# Altium schematic sheet Mezzanine TXR-4 met sensor.SchDoc: SZG-TEMPLATE-TXR
size B; Organization: Opal Kelly; Address1: 13500 SW 72nd Ave STE 100; Address2: Portland, OR  97223; Address3: 217.391.3724; Address4: http://www.opalkelly.com; DocumentNumber: xxx; Revision: 1; SheetNumber: 1; SheetTotal: 1; PageSetup: Record=PageOptions|CenterHorizontal=True|CenterVertical=True|PrintScale=0.52|XCorrection=1.00|YCorrection=1.00|PrintKind=0|BorderSize=5000000|LeftOffset=0|BottomOffset=0|Orientation=2|PaperLength=1000|PaperWidth=1000|Scale=100|PaperSource=7|PrintQuality=-4|MediaType=1|DitherType=10|PaperKind=Letter|PrintScaleMode=1
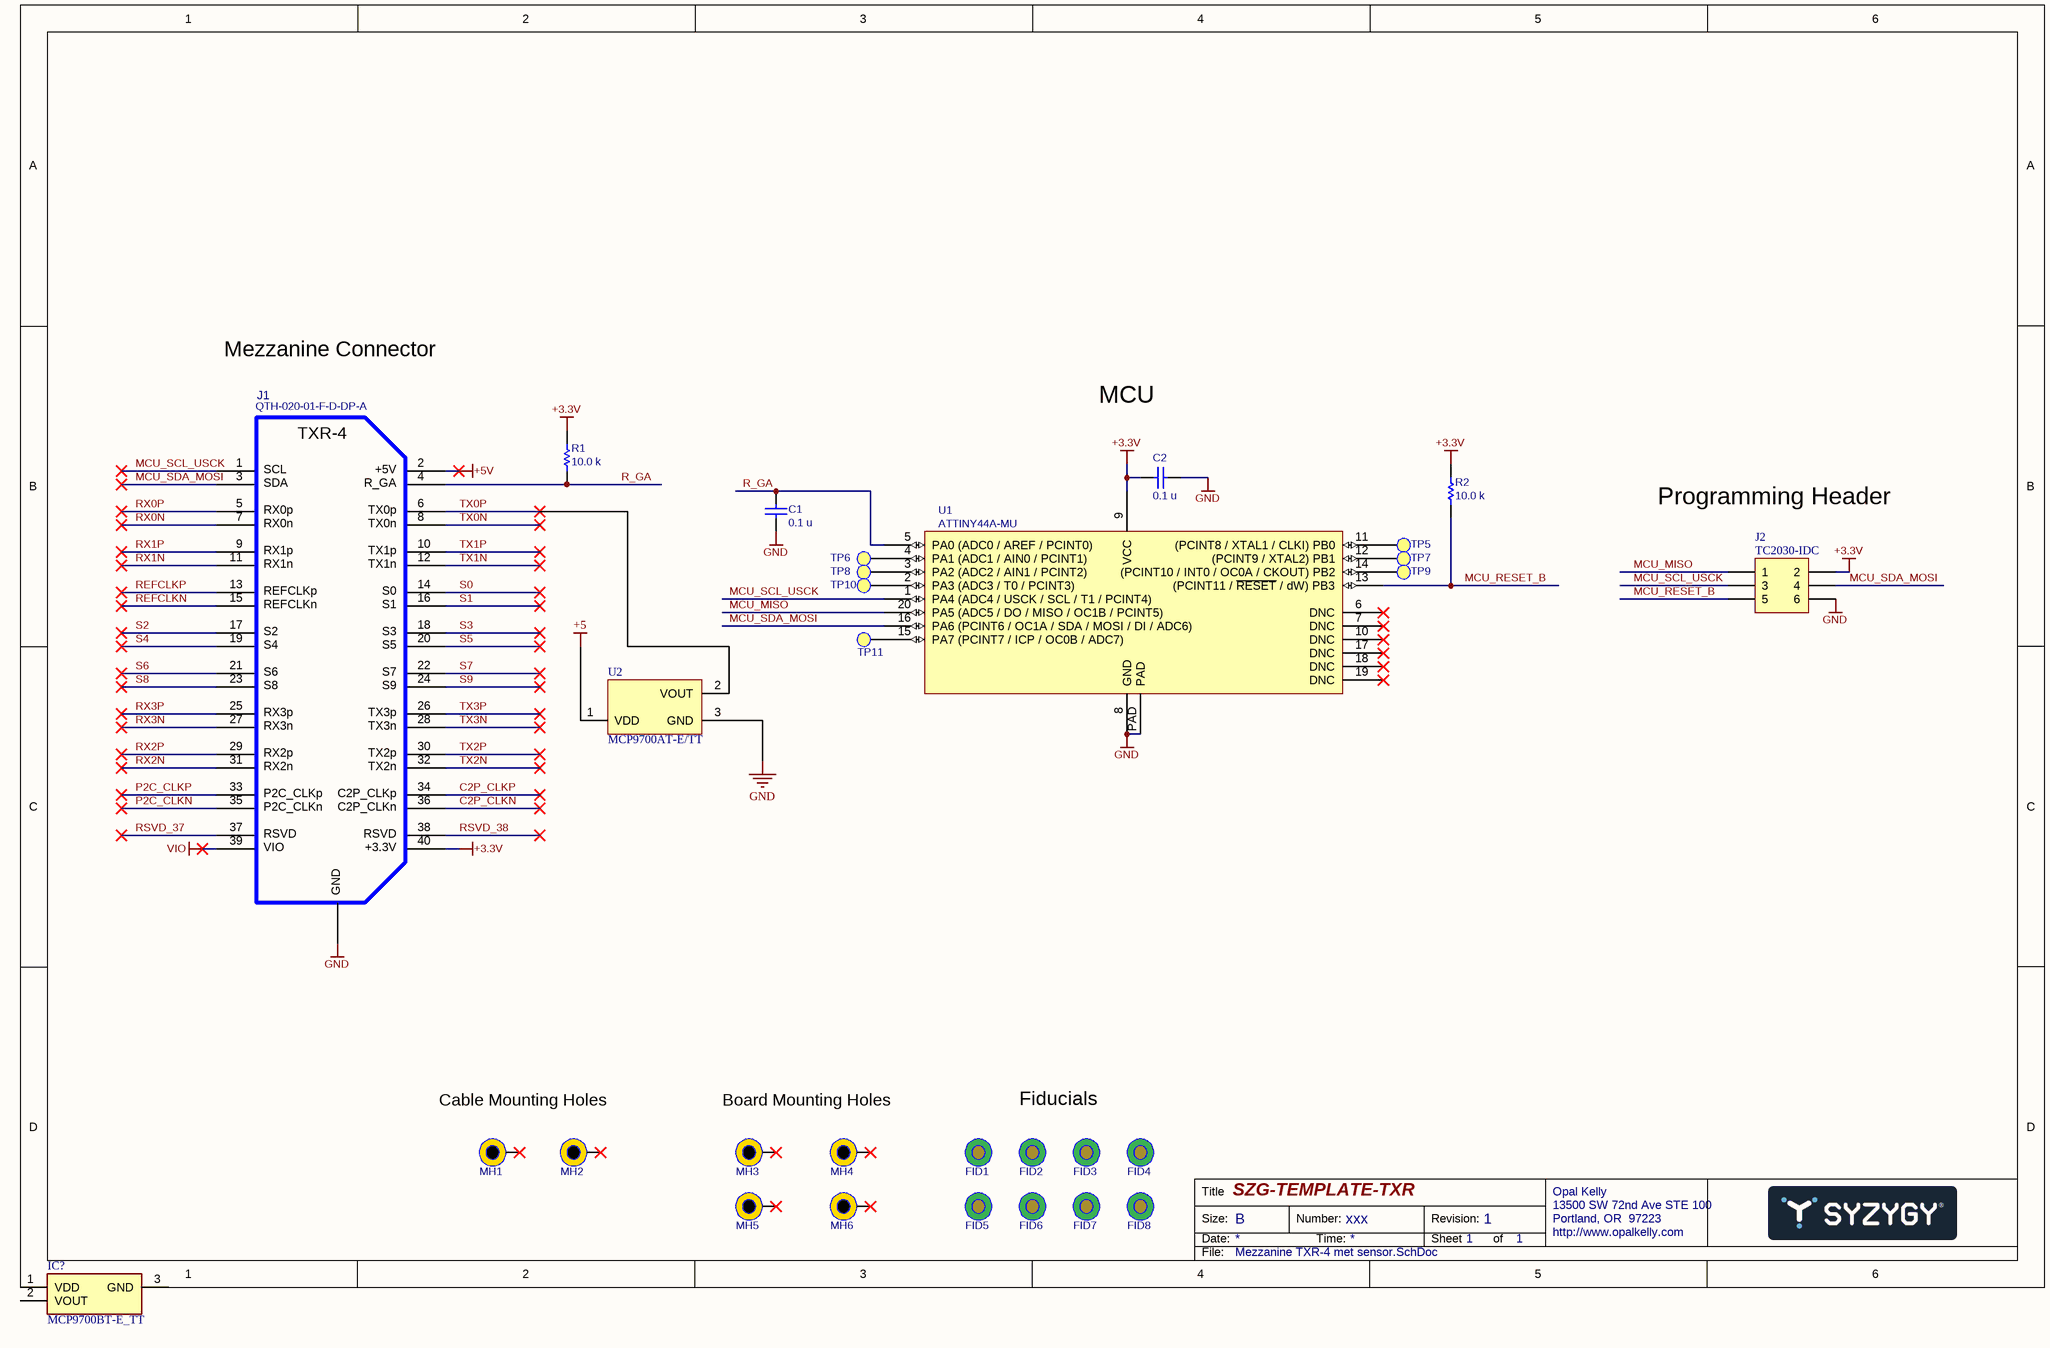
[diagram p0: Mezzanine TXR-4 met sensor.SchDoc]

## Parts
C1  value 0.1 u  [CAPC1005X06N]  (hidden comment: C0402C104K8PACTU)
C2  value 0.1 u  [CAPC1005X06N]  (hidden comment: C0402C104K8PACTU)
FID1  FIDUCIAL  [FID1MM/2MM-SS]  (value not drawn)
FID2  FIDUCIAL  [FID1MM/2MM-SS]  (value not drawn)
FID3  FIDUCIAL  [FID1MM/2MM-SS]  (value not drawn)
FID4  FIDUCIAL  [FID1MM/2MM-SS]  (value not drawn)
FID5  FIDUCIAL  [FID1MM/2MM-SS]  (value not drawn)
FID6  FIDUCIAL  [FID1MM/2MM-SS]  (value not drawn)
FID7  FIDUCIAL  [FID1MM/2MM-SS]  (value not drawn)
FID8  FIDUCIAL  [FID1MM/2MM-SS]  (value not drawn)
IC?  MCP9700BT-E_TT  [SOT95P237X112-3N]
J1  manufacturer_pn: QTH-020-01-F-D-DP-A  [QTH-020-01-X-D-DP-A-L]  (hidden comment: 40-pin, ground protection in middle)
J2  Manufacturer_PN: TC2030-IDC  [TC2030-DUAL]
MH1  MTG  [MTG-3.2/6.5-PTH]  (value not drawn)
MH2  MTG  [MTG-3.2/6.5-PTH]  (value not drawn)
MH3  MTG  [MTG-3.2/6.5-PTH]  (value not drawn)
MH4  MTG  [MTG-3.2/6.5-PTH]  (value not drawn)
MH5  MTG  [MTG-3.2/6.5-PTH]  (value not drawn)
MH6  MTG  [MTG-3.2/6.5-PTH]  (value not drawn)
R1  value 10.0 k  [RESC1005X06N]  (hidden comment: CRCW040210K0FKED)
R2  value 10.0 k  [RESC1005X06N]  (hidden comment: CRCW040210K0FKED)
TP5  TESTPOINT-SMD20  [TP-SMD20]  (value not drawn)
TP6  TESTPOINT-SMD20  [TP-SMD20]  (value not drawn)
TP7  TESTPOINT-SMD20  [TP-SMD20]  (value not drawn)
TP8  TESTPOINT-SMD20  [TP-SMD20]  (value not drawn)
TP9  TESTPOINT-SMD20  [TP-SMD20]  (value not drawn)
TP10  TESTPOINT-SMD20  [TP-SMD20]  (value not drawn)
TP11  TESTPOINT-SMD20  [TP-SMD20]  (value not drawn)
U1  ATTINY44A-MU  [QFN-EP-20]
U2  MCP9700AT-E/TT  [SOT-23-TT3_L]

## Nets
+3.3V: C2.2 J1.40 J2.2 R1.2 R2.2 U1.9(VCC)
+5: U2.1(VDD)
+5V: J1.2
GND: C1.1 C2.1 J1.0(GND) J2.6 U1.8(GND) U1.PAD U2.3(GND)
VIO: J1.39
C2P_CLKN: J1.36
C2P_CLKP: J1.34
MCU_MISO: J2.1 U1.20(PA5_(ADC5_/_DO_/_MISO_/_OC1B_/_PCINT5))
MCU_RESET_B: J2.5 R2.1 U1.13((PCINT11_/_~{RESET}_/_dW)_PB3)
MCU_SCL_USCK: J1.1 J2.3 U1.1(PA4_(ADC4_/_USCK_/_SCL_/_T1_/_PCINT4))
MCU_SDA_MOSI: J1.3 J2.4 U1.16(PA6_(PCINT6_/_OC1A_/_SDA_/_MOSI_/_DI_/_ADC6))
P2C_CLKN: J1.35
P2C_CLKP: J1.33
R_GA: C1.2 J1.4 R1.1 U1.5(PA0_(ADC0_/_AREF_/_PCINT0))
REFCLKN: J1.15
REFCLKP: J1.13
RSVD_37: J1.37
RSVD_38: J1.38
RX0N: J1.7
RX0P: J1.5
RX1N: J1.11
RX1P: J1.9
RX2N: J1.31
RX2P: J1.29
RX3N: J1.27
RX3P: J1.25
S0: J1.14
S1: J1.16
S2: J1.17
S3: J1.18
S4: J1.19
S5: J1.20
S6: J1.21
S7: J1.22
S8: J1.23
S9: J1.24
TX0N: J1.8
TX0P: J1.6 U2.2(VOUT)
TX1N: J1.12
TX1P: J1.10
TX2N: J1.32
TX2P: J1.30
TX3N: J1.28
TX3P: J1.26
NetTP5_1: TP5.1(PIN) U1.11((PCINT8_/_XTAL1_/_CLKI)_PB0)
NetTP6_1: TP6.1(PIN) U1.4(PA1_(ADC1_/_AIN0_/_PCINT1))
NetTP7_1: TP7.1(PIN) U1.12((PCINT9_/_XTAL2)_PB1)
NetTP8_1: TP8.1(PIN) U1.3(PA2_(ADC2_/_AIN1_/_PCINT2))
NetTP9_1: TP9.1(PIN) U1.14((PCINT10_/_INT0_/_OC0A_/_CKOUT)_PB2)
NetTP10_1: TP10.1(PIN) U1.2(PA3_(ADC3_/_T0_/_PCINT3))
NetTP11_1: TP11.1(PIN) U1.15(PA7_(PCINT7_/_ICP_/_OC0B_/_ADC7))

Not connected (* = marked no-connect by the designer): IC? 1(VDD) 2(VOUT) 3(GND); MH1 1*; MH2 1*; MH3 1*; MH4 1*; MH5 1*; MH6 1*; U1 6(DNC)* 7(DNC)* 10(DNC)* 17(DNC)* 18(DNC)* 19(DNC)*

## Notes on the sheet
- Mezzanine Connector
- MCU
- Programming Header
- Cable Mounting Holes
- Board Mounting Holes
- Fiducials
- Title
- Size:
- Date:
- B
- Number:
- Time:
- Revision:
- Sheet
- of
- File:
- (in symbol 001605) TXR-4; SCL; +5V; SDA; R_GA; RX0p; TX0p; RX0n; TX0n; RX1p; TX1p; RX1n; TX1n; REFCLKp; S0; REFCLKn; S1; S2; S3; S4; S5; S6; S7; S8; S9; RX3p; TX3p; RX3n; TX3n; RX2p; TX2p; RX2n; TX2n; P2C_CLKp; C2P_CLKp; P2C_CLKn; C2P_CLKn; RSVD; VIO; +3.3V

## Library data of the parts
C1 C2 = 000070: Ceramic capacitor; Manufacturer: Kemet; partnumber: 000070; Description 2: SM-0402, 10%, 10v; ValueFloat: 1E-7; Tolerance (%): 10; Manufacturer_PN: C0402C104K8PACTU
  C1: updated_on: 5/15/2017 4:50:04 PM
  C2: updated_on: 11/17/2016 12:16:56 PM
FID1-FID8 = FIDUCIAL: PCB fiducial
IC? = MCP9700BT-E_TT: Integrated Circuit; Manufacturer_Name: Microchip; Manufacturer_Part_Number: MCP9700BT-E/TT; Datasheet Link: https://www.arrow.com/en/products/mcp9700bt-ett/microchip-technology?region=nac; Height: 1.12mm; Mouser Part Number: 494-MCP9700BT-E/TT; Mouser Price/Stock: https://www.mouser.co.uk/ProductDetail/Microchip-Technology/MCP9700BT-E-TT?qs=Y0Uzf4wQF3lsXhjo%252Bepn1A%3D%3D; Arrow Part Number: MCP9700BT-E/TT; Arrow Price/Stock: https://www.arrow.com/en/products/mcp9700bt-ett/microchip-technology?region=nac
J1 = 001605: 0.5mm hi-speed, high-density header (female); manufacturer: Samtec; AligniPartNumber: 001605; parttype: Connector
J2 = 002062: Tag-Connect 6-pin Plug-of-Nails spring-pin cable footprint; AligniPartNumber: 002062; Manufacturer: Tag-Connect; parttype: Connector
MH1-MH6 = MTG: Mounting hole
R1 R2 = 001521: Thick-film resistor; Manufacturer: Vishay; partnumber: 001521; Description 2: SM-0402, 1%, 1/16W; ValueFloat: 10000; Tolerance (%): 1; x_lifecycle_status: Production; Manufacturer_PN: CRCW040210K0FKED; updated_on: 3/21/2017 2:29:49 PM
TP5-TP11 = TESTPOINT-SMD20: Test point, surface-mount, 20mil
U1 = 001552: 8-bit MCU, 4 KB flash, 256 bytes EEPROM; Manufacturer: Microchip; partnumber: 001552; x_lifecycle_status: Production; Manufacturer_PN: ATTINY44A-MU; updated_on: 5/23/2017 10:51:21 AM
U2 = CMP-0192-00218-1: Low-Power Linear Active Thermistor IC, 3-Pin SOT-23, Extended Temperature, Tape and Reel; PackageReference: SOT-23-TT3; PackageVersion: revBB, Aug-2009; DatasheetVersion: revE, Apr-2009; Code_IPC: SOT23-3; PackageDescription: 3-Lead Plastic Small Outline Transistor (TT) [SOT-23]